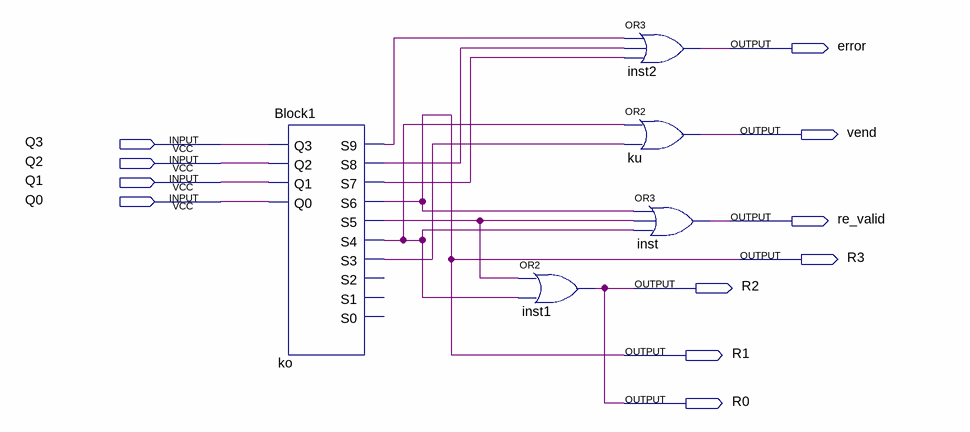
[diagram p0: schematic sheet]
// Quartus schematic Block2.bdf as structural Verilog: 5 symbols, 11 pins
module Block2 (
  input  Q3,
  input  Q2,
  input  Q1,
  input  Q0,
  output error,
  output vend,
  output re_valid,
  output R3,
  output R2,
  output R1,
  output R0
);

  wire ko_s3, ko_s4, ko_s5, ko_s7, ko_s8, ko_s9;

  Block1 ko (
    .Q3(Q3), .Q2(Q2), .Q1(Q1), .Q0(Q0), .S9(ko_s9), .S8(ko_s8), .S7(ko_s7), .S6(R1), .S5(ko_s5), .S4(ko_s4),
    .S3(ko_s3));  // open: S2, S1, S0
  or inst1 (R0, ko_s5, ko_s4);
  or inst2 (error, ko_s9, ko_s8, ko_s7);
  or ku (vend, ko_s4, ko_s3);
  or inst (re_valid, R1, ko_s5, ko_s4);

  assign R2 = R0;
  assign R3 = R1;
endmodule
